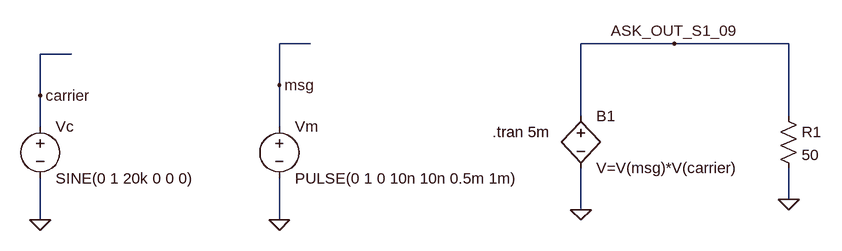
[diagram p0: schematic Q7 Amplitude Shift Keying (ASK).asc]
Q7 Amplitude Shift Keying (ASK).asc, the LTspice schematic file:
Version 4
SHEET 1 1336 680
WIRE 544 -32 496 -32
WIRE 1104 -32 960 -32
WIRE 1280 -32 1104 -32
WIRE 176 -16 128 -16
WIRE 496 32 496 -32
WIRE 128 48 128 -16
WIRE 960 80 960 -32
WIRE 1280 80 1280 -32
WIRE 128 96 128 48
WIRE 496 96 496 32
WIRE 1280 208 1280 160
WIRE 960 224 960 160
WIRE 128 240 128 176
WIRE 496 240 496 176
FLAG 128 240 0
FLAG 128 48 carrier
FLAG 496 240 0
FLAG 496 32 msg
FLAG 960 224 0
FLAG 1280 208 0
FLAG 1104 -32 ASK_OUT_S1_09
SYMBOL voltage 128 80 R0
WINDOW 123 0 0 Left 0
WINDOW 39 0 0 Left 0
SYMATTR InstName Vc
SYMATTR Value SINE(0 1 20k 0 0 0)
SYMBOL voltage 496 80 R0
WINDOW 123 0 0 Left 0
WINDOW 39 0 0 Left 0
SYMATTR InstName Vm
SYMATTR Value PULSE(0 1 0 10n 10n 0.5m 1m)
SYMBOL bv 960 64 R0
SYMATTR InstName B1
SYMATTR Value V=V(msg)*V(carrier)
SYMBOL res 1264 64 R0
SYMATTR InstName R1
SYMATTR Value 50
TEXT 824 104 Left 2 !.tran 5m

The netlist it stands for:
* Q7 Amplitude Shift Keying (ASK).asc
Vc carrier 0 SINE(0 1 20k 0 0 0)
Vm msg 0 PULSE(0 1 0 10n 10n 0.5m 1m)
B1 ASK_OUT_S1_09 0 V=V(msg)*V(carrier)
R1 ASK_OUT_S1_09 0 50
.tran 5m
.backanno
.end